# EAGLE design ALMOST4ALLMINI (EAGLE 7.3.0)
CNAME: ALMOST 4 ALL MYSENSORS MINI; CREVISION: 1.1; DESIGNER: joseraj
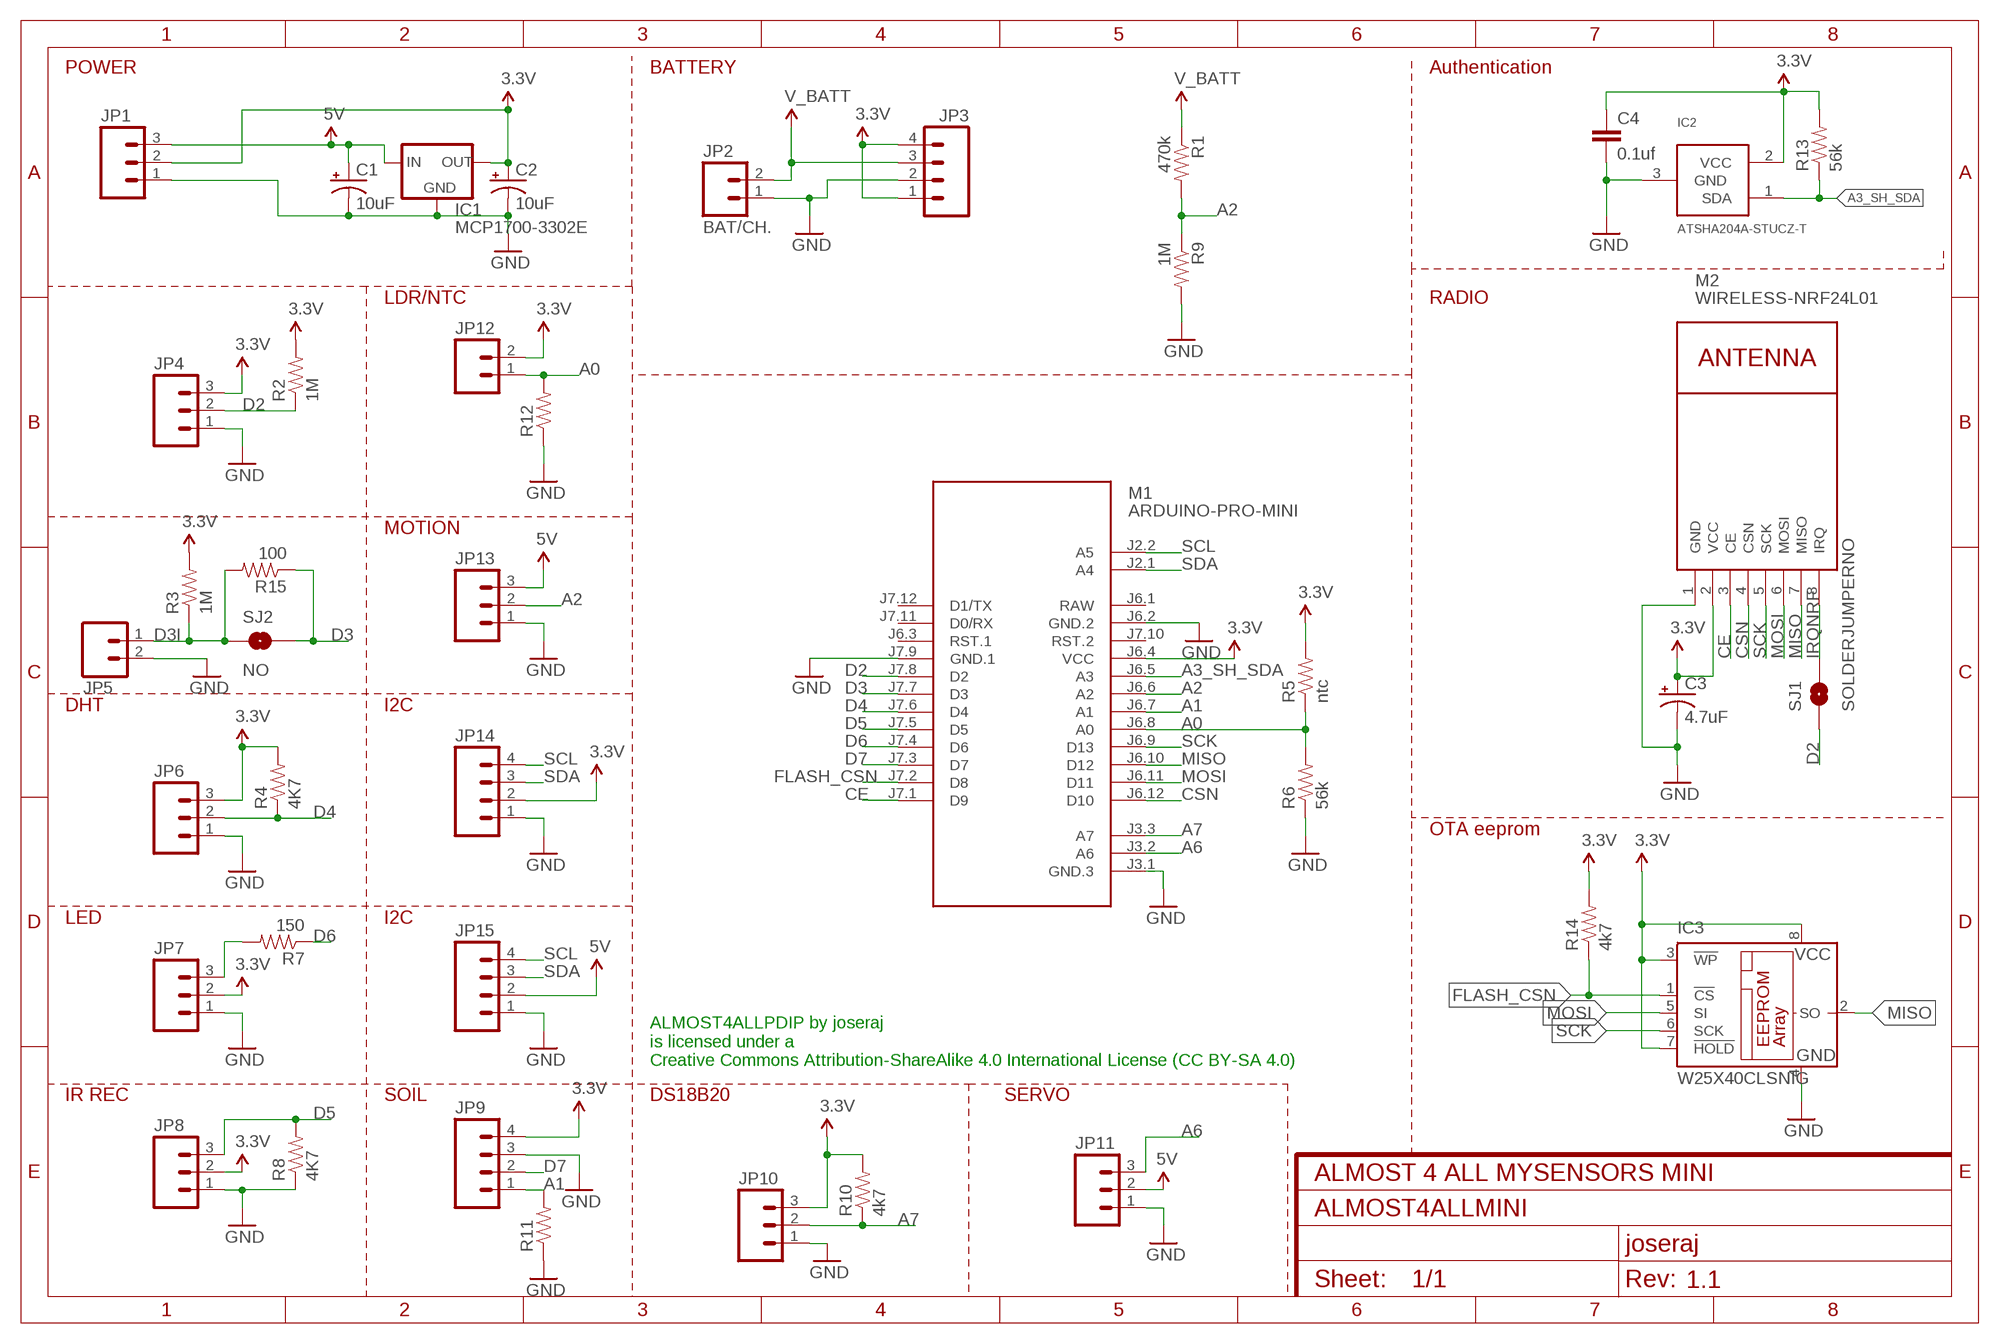
[diagram p0: schematic, sheet 1]

## Parts
C1  10uF  CAP_POLPTH2  [CPOL-RADIAL-10UF-25V]
C2  10uF  CAP_POLPTH2  [CPOL-RADIAL-10UF-25V]
C3  4.7uF  CAP_POLPTH2  [CPOL-RADIAL-10UF-25V]
C4  0.1uf  CAP0805  [0805]
IC1  MCP1700-3302E  MCP1700TRI  [TO92]
IC2  ATSHA204A-STUCZ-T  ATSHA204A  [SOT23]
IC3  W25X40CLSNIG  25LC080SN  [SO-08]
JP1  M03POLAR_LOCK  [MOLEX-1X3_LOCK]
JP2  BAT/CH.  M02POLAR_LOCK  [MOLEX-1X2_LOCK]
JP3  M04NO_SILK_ALL_ROUND  [1X04_NO_SILK_ALL_ROUND]
JP4  M03POLAR_LOCK  [MOLEX-1X3_LOCK]
JP5  M02POLAR_LOCK  [MOLEX-1X2_LOCK]
JP6  M03POLAR_LOCK  [MOLEX-1X3_LOCK]
JP7  M03POLAR_LOCK  [MOLEX-1X3_LOCK]
JP8  M03POLAR_LOCK  [MOLEX-1X3_LOCK]
JP9  M04POLAR_LOCK  [MOLEX-1X4_LOCK]
JP10  M03POLAR_LOCK  [MOLEX-1X3_LOCK]
JP11  M03POLAR_LOCK  [MOLEX-1X3_LOCK]
JP12  M02POLAR_LOCK  [MOLEX-1X2_LOCK]
JP13  M03POLAR_LOCK  [MOLEX-1X3_LOCK]
JP14  M04POLAR_LOCK  [MOLEX-1X4_LOCK]
JP15  M04POLAR_LOCK  [MOLEX-1X4_LOCK]
M1  ARDUINO-PRO-MINI  ARDUINO-PRO-MINI-3.3V#NP  [ARDUINO-PRO-MINI#NP]
M2  WIRELESS-NRF24L01  [WIRELESS-NRF24L01]
R1  470k  RESISTOR0805-RES  [0805]
R2  1M  RESISTOR0805-RES  [0805]
R3  1M  RESISTOR0805-RES  [0805]
R4  4K7  RESISTOR0805-RES  [0805]
R5  ntc  RESISTOR0805-RES  [0805]
R6  56k  RESISTOR0805-RES  [0805]
R7  150  RESISTOR0805-RES  [0805]
R8  4K7  RESISTOR0805-RES  [0805]
R9  1M  RESISTOR0805-RES  [0805]
R10  4k7  RESISTOR0805-RES  [0805]
R11  RESISTOR0805-RES  [0805]
R12  RESISTOR0805-RES  [0805]
R13  56k  RESISTOR0805-RES  [0805]
R14  4k7  RESISTOR0805-RES  [0805]
R15  100  RESISTOR0805-RES  [0805]
SJ1  SOLDERJUMPERNO  [SJ_2S-NO]
SJ2  NO  SOLDERJUMPERNO  [SJ_2S-NO]

## Nets
3.3V: C2.1(+) C3.1(+) C4.1 IC1.3(OUT) IC2.2(VCC) IC3.3(!WP) IC3.7(!HOLD) IC3.8(VCC) JP1.2 JP3.1 JP3.4 JP4.3 JP6.3 JP7.2 JP8.2 JP9.4 JP10.3 JP12.2 JP14.2 M1.J6.4(VCC) M2.2(VCC) R2.2 R3.2 R4.2 R5.2 R10.2 R13.2 R14.2
5V: C1.1(+) IC1.2(IN) JP1.3 JP11.2 JP13.3 JP15.2
A0: JP12.1 M1.J6.8(A0) R5.1 R6.2 R12.2
A1: JP9.1 M1.J6.7(A1) R11.2
A2: JP13.2 M1.J6.6(A2) R1.2 R9.1
A3_SH_SDA: IC2.1(SDA) M1.J6.5(A3) R13.1
A6: JP11.3 M1.J3.2(A6)
A7: JP10.2 M1.J3.3(A7) R10.1
CE: M1.J7.1(D9) M2.3(CE)
CSN: M1.J6.12(D10) M2.4(CSN)
D2: JP4.2 M1.J7.8(D2) R2.1 SJ1.1
D3: M1.J7.7(D3) R15.1 SJ2.2
D3I: JP5.1 R3.1 R15.2 SJ2.1
D4: JP6.2 M1.J7.6(D4) R4.1
D5: JP8.3 M1.J7.5(D5) R8.2
D6: M1.J7.4(D6) R7.1
D7: JP9.2 M1.J7.3(D7)
FLASH_CSN: IC3.1(!CS) M1.J7.2(D8) R14.1
GND: C1.2(-) C2.2(-) C3.2(-) C4.2 IC1.1(GND) IC2.3(GND) IC3.4(GND) JP1.1 JP2.1 JP3.2 JP4.1 JP5.2 JP6.1 JP7.1 JP8.1 JP9.3 JP10.1 JP11.1 JP13.1 JP14.1 JP15.1 M1.J3.1(GND.3) M1.J6.2(GND.2) M1.J7.9(GND.1) M2.1(GND) R6.1 R8.1 R9.2 R11.1 R12.1
IRQNRF: M2.8(IRQ) SJ1.2
MISO: IC3.2(SO) M1.J6.10(D12) M2.7(MISO)
MOSI: IC3.5(SI) M1.J6.11(D11) M2.6(MOSI)
N$5: JP7.3 R7.2
SCK: IC3.6(SCK) M1.J6.9(D13) M2.5(SCK)
SCL: JP14.4 JP15.4 M1.J2.2(A5)
SDA: JP14.3 JP15.3 M1.J2.1(A4)
V_BATT: JP2.2 JP3.3 R1.1
Unconnected: M1.J6.3(RST.1) M1.J7.10(RST.2) M1.J7.11(D0/RX) M1.J7.12(D1/TX)

## Notes on the sheet
- POWER | BATTERY | Authentication
- LDR/NTC | RADIO
- MOTION
- DHT | I2C
- OTA eeprom
- LED | I2C
- ALMOST4ALLPDIP by joseraj 
  is licensed under a 
  Creative Commons Attribution-ShareAlike 4.0 International License (CC BY-SA 4.0)
- IR REC | SOIL | DS18B20 | SERVO

## Power pins joined to a net without a drawn wire
RAW: M1.J6.1(RAW)

## Library data of the parts
C1-C3 = SparkFun-Capacitors:CAP_POL: Capacitor Polarized These are standard SMD and PTH capacitors. Normally 10uF, 47uF, and 100uF in electrolytic and tantalum varieties. Always verify the external diameter of the through hole cap, it varies with capacity, voltage, and manufacturer. The EIA devices should be standard.
C4 = SparkFun-Passives:CAP: Capacitor Standard 0603 ceramic capacitor, and 0.1" leaded capacitor.
IC1 = adafruit:MCP1700: VOLTAGE REGULATOR
IC2 = Sensor_tbowmo:ATSHA204A
IC3 = microchip:25*: Serial EEPROM 4K/ 8K , SPI bus; MF: MICROCHIP; MPN: 25LC080/SN; OC_FARNELL: 1137302; OC_NEWARK: 96K4092
JP1 JP4 JP6-JP8 JP10 JP11 JP13 = jraj:M03: Header 3 Standard 3-pin 0.1" header. Use with straight break away headers (SKU : PRT-00116), right angle break away headers (PRT-00553), swiss pins (PRT-00743), machine pins (PRT-00117), and female headers (PRT-00115). Molex polarized connector foot print use with SKU : PRT-08232 with associated crimp pins and housings.
JP2 JP5 JP12 = jraj:M02: Standard 2-pin 0.1" header. Use with - straight break away headers ( PRT-00116) - right angle break away headers (PRT-00553) - swiss pins (PRT-00743) - machine pins (PRT-00117) - female headers (PRT-00115) Molex polarized connector foot print use with: PRT-08233 with associated crimp pins and housings. 2.54_SCREWTERM for use with PRT-10571. 3.5mm Screw Terminal footprints for PRT-08084 5mm Screw Terminal footprints for use with PRT-08432
JP3 JP9 JP14 JP15 = jraj:M04: Header 4 Standard 4-pin 0.1" header. Use with straight break away headers (SKU : PRT-00116), right angle break away headers (PRT-00553), swiss pins (PRT-00743), machine pins (PRT-00117), and female headers (PRT-00115). Molex polarized connector foot print use with SKU : PRT-08231 with associated crimp pins and housings. 1MM SMD Version SKU: PRT-10208
M1 = diy-modules:ARDUINO-PRO-MINI-*#NP: Arduino Pro Mini without programming pads
M2 = jraj:WIRELESS-NRF24L01: 2.4 GHz Wireless Module based on NRF24L01 chip
R1-R15 = SparkFun-Passives:RESISTOR: Resistor Basic schematic elements and footprints for 0603, 1206, and PTH resistors.
SJ1 SJ2 = SparkFun-Retired:SOLDERJUMPER: Solder Jumper Standard SMD solder jumper. Used to automate production. Two varients : Normally Open and Normally Closed are the same, but have different paste layers. NC will have a large amount of paste and should jumper during reflow.

## Board
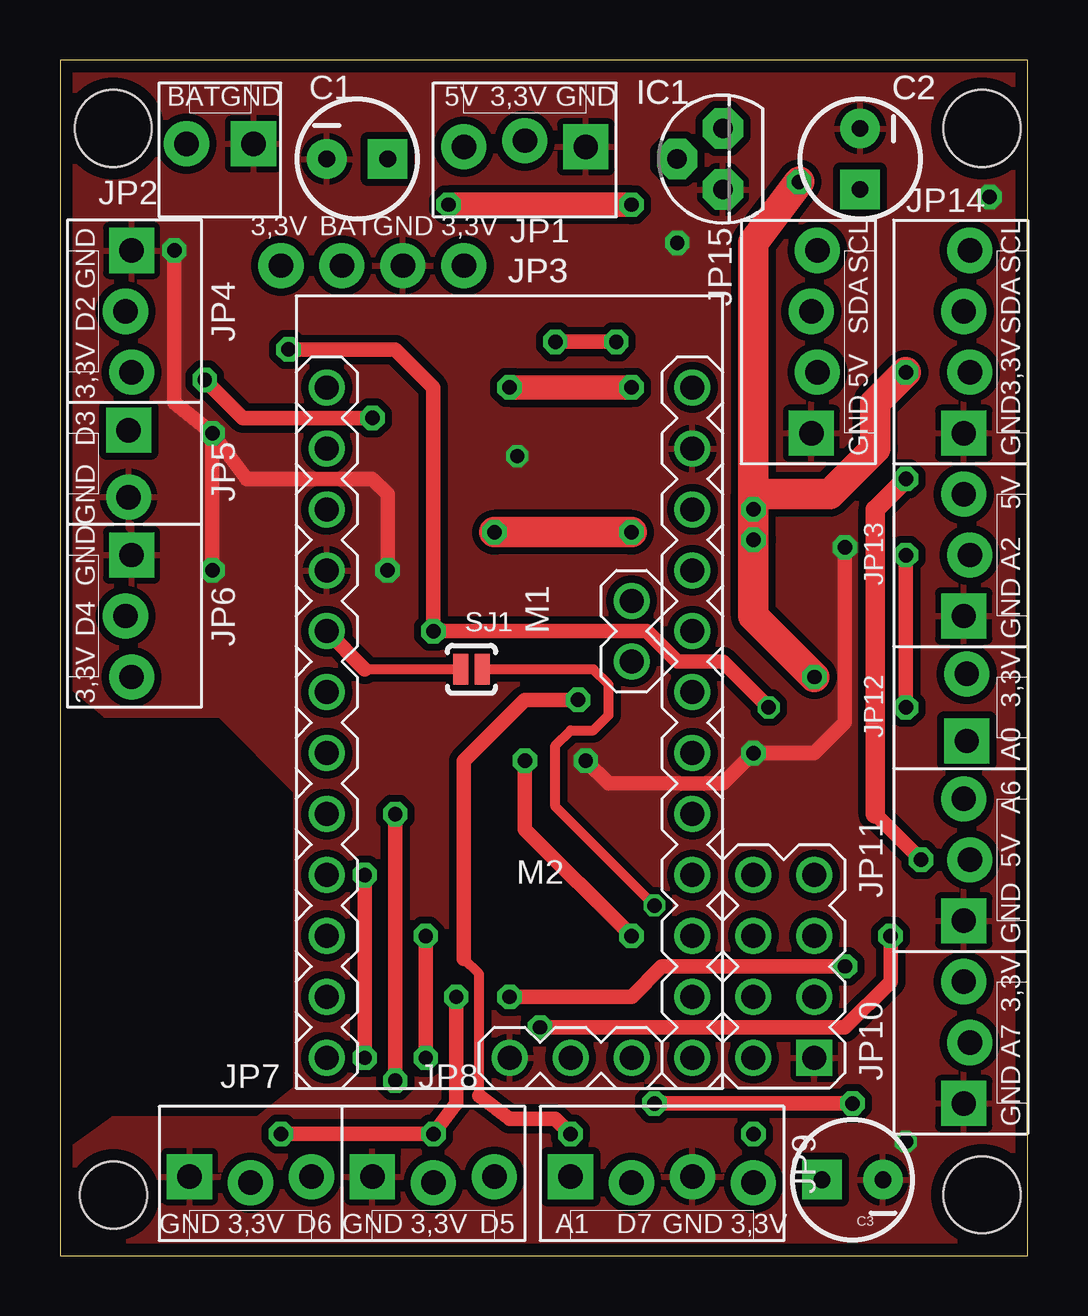
[diagram p1: board, top side]
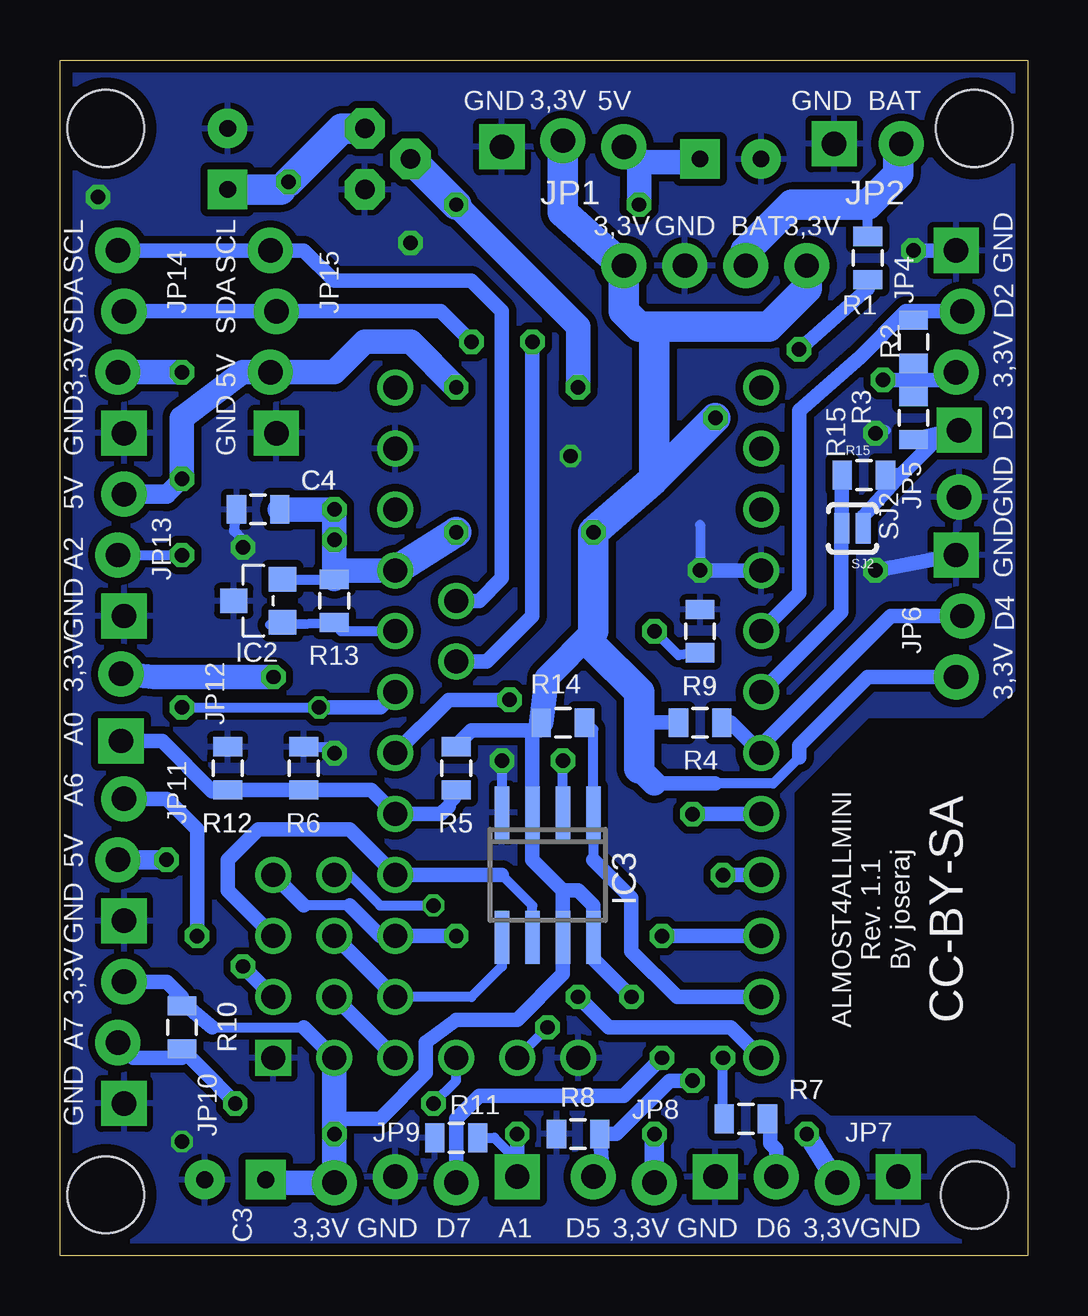
[diagram p2: board, bottom side, seen from below]

Size 40.32 x 49.85 mm. Coordinates in mm from the lower left corner, seen from the top.
Outline: 0,0 40.32,0 40.32,49.85 0,49.85 0,0
Copper layers (1*16): Top 0.035mm / dielectric 1.6mm / Bottom 0.035mm
Design rules "Elecrow_2-layer_PCB_eagle_rule": minimum track width 6mil, minimum drill 12mil, track to track 6mil, track to pad 6mil, pad to pad 6mil, via to via 8mil, smd to smd 0mil, copper to edge 20mil, drill to drill 10mil, minimum pad ring 6mil, minimum via ring 6mil, stop-mask expansion 0mil, vias tented up to drill 100mil, thermal gap 10mil
Holes 2.8 mm at 2.22,2.54
Holes 3.2 mm at 38.42,2.54 2.22,46.99 38.42,46.99

### Footprints (pad centres in the part's own frame; a part is rotated, then mirrored left to right if it is on the bottom)
CPOL-RADIAL-10UF-25V = drill 0.7 pad 1.651 square: 1 1.27,0 | drill 0.7 pad 1.651: 2 -1.27,0
0805 = smd 0.8 x 1.2: 1 -0.9,0; 2 0.9,0
TO92 = drill 0.813 pad 1.676 octagon: 1 -1.27,0; 2 0,1.905; 3 1.27,0
SOT23 = smd 1.016 x 1.143: 1 -0.889,-1.016; 2 0.889,-1.016; 3 0,1.016
SO-08 = smd 0.6 x 2.2: 1 -1.905,-2.6; 2 -0.635,-2.6; 3 0.635,-2.6; 4 1.905,-2.6; 5 1.905,2.6; 6 0.635,2.6; 7 -0.635,2.6; 8 -1.905,2.6
MOLEX-1X3_LOCK = drill 1.016 pad 1.88 square: 1 0,0.127 | drill 1.016 pad 1.88: 2 2.54,-0.127; 3 5.08,0.127
MOLEX-1X2_LOCK = drill 1.016 pad 1.88 square: 1 -0.127,0 | drill 1.016 pad 1.88: 2 2.667,0
1X04_NO_SILK_ALL_ROUND = drill 1.016 pad 1.88: 1 0,0; 2 2.54,0; 3 5.08,0; 4 7.62,0
MOLEX-1X4_LOCK = drill 1.016 pad 1.88 square: 1 0,0.127 | drill 1.016 pad 1.88: 2 2.54,-0.127; 3 5.08,0.127; 4 7.62,-0.127
ARDUINO-PRO-MINI#NP = drill 1: J2.1 -1.27,5.08; J2.2 -3.81,5.08; J3.1 15.24,0; J3.2 15.24,2.54; J3.3 15.24,5.08; J6.1 -12.7,7.62; J6.2 -10.16,7.62; J6.3 -7.62,7.62; J6.4 -5.08,7.62; J6.5 -2.54,7.62; J6.6 0,7.62; J6.7 2.54,7.62; J6.8 5.08,7.62; J6.9 7.62,7.62; J6.10 10.16,7.62; J6.11 12.7,7.62; J6.12 15.24,7.62; J7.1 15.24,-7.62; J7.2 12.7,-7.62; J7.3 10.16,-7.62; J7.4 7.62,-7.62; J7.5 5.08,-7.62; J7.6 2.54,-7.62; J7.7 0,-7.62; J7.8 -2.54,-7.62; J7.9 -5.08,-7.62; J7.10 -7.62,-7.62; J7.11 -10.16,-7.62; J7.12 -12.7,-7.62
WIRELESS-NRF24L01 = drill 1 square: 1 -12.7,6.35 | drill 1: 2 -10.16,6.35; 3 -12.7,3.81; 4 -10.16,3.81; 5 -12.7,1.27; 6 -10.16,1.27; 7 -12.7,-1.27; 8 -10.16,-1.27
SJ_2S-NO = smd 0.635 x 1.27: 1 -0.45,0; 2 0.45,0

### Placement (x,y rotation side)
C1  12.38,45.72 0 top
C2  33.34,45.72 270 top
C3  33.02,3.17 180 top
C4  32.07,31.11 180 bottom
IC1  27.62,45.72 90 top
IC2  32.07,27.3 90 bottom
IC3  20,15.88 180 bottom
JP1  21.91,46.35 180 top
JP2  7.94,46.35 180 top
JP3  16.83,41.27 180 top
JP4  2.86,41.91 270 top
JP5  2.86,34.29 270 top
JP6  2.86,29.21 270 top
JP7  5.4,3.17 0 top
JP8  13.02,3.17 0 top
JP9  21.27,3.17 0 top
JP10  37.78,6.35 90 top
JP11  37.78,13.97 90 top
JP12  37.78,21.59 90 top
JP13  37.78,26.67 90 top
JP14  37.78,34.29 90 top
JP15  31.43,34.29 90 top
M1  18.73,23.5 270 top
M2  18.73,14.61 180 top
R1  6.67,41.59 270 bottom
R2  4.76,38.1 270 bottom
R3  4.76,34.92 90 bottom
R4  13.65,22.23 180 bottom
R5  23.81,20.32 90 bottom
R6  30.16,20.32 270 bottom
R7  11.75,5.71 0 bottom
R8  18.73,5.08 0 bottom
R9  13.65,26.04 90 bottom
R10  35.24,9.53 90 bottom
R11  23.81,4.92 0 bottom
R12  33.34,20.32 270 bottom
R13  28.89,27.3 90 bottom
R14  19.37,22.23 180 bottom
R15  6.83,32.54 0 bottom
SJ1  17.14,24.45 0 top
SJ2  7.3,30.32 180 bottom

### Tracks (layer width: path | path; a pad name or v marks a point on that pad's centre or on a via)
3.3V  (via drill 0.6 pad 1.02)
  Top 0.61: v6.03,36.51 7.62,34.92 v13.02,34.92 | v9.21,5.08 v15.56,5.08 16.51,6.35 v16.51,10.79
  Top 1.27: v31.43,24.13 28.89,26.67 v28.89,29.84 v28.89,31.11 | v28.89,31.11 28.89,31.75 32.07,31.75 33.97,33.66 33.97,35.56 v35.24,36.83 | v23.81,30.16 v18.1,30.16 | v30.8,44.77 28.89,42.23 v28.89,31.11
  Bottom 0.406: IC2.2 29,28.19 R13.2 28.62,28.57 | 20.64,21.95 R14.2 | 13.02,19.68 10.6,19.68 9.53,20.77 | 30.16,9.53 33.97,9.53 R10.2 | JP9.4 28.38,3.17 28.89,3.17 | 18.1,12.38 IC3.8 | 19.37,45.85 JP1.2 | 35.51,10.79 35.24,10.79 | 31.11,44.45 v30.8,44.77 | 23.81,21.27 R5.2 | R2.2 4.76,36.51 R3.2 | 31.7,3.05 31.75,3.05 C3.1
  Bottom 0.61: 19.37,15.24 IC3.7 19.37,11.75 21.27,9.84 23.81,9.84 25.08,8.89 25.08,7.62 26.99,5.71 28.89,5.71 | 19.37,15.24 20.64,16.51 IC3.3 20.64,21.91 | IC3.8 18.1,14.61 18.73,15.24 19.37,15.24 | 20.64,21.91 20.64,21.95 | 13.02,19.68 15.56,19.68 | JP10.3 35.88,11.43 35.24,10.79 | 35.51,10.79 33.97,9.53 | 30.16,9.53 M2.2 | 9.53,20.77 9.53,21.27 6.67,24.13 JP6.3 | v16.51,10.79 18.1,12.38 | R4.2 16.19,22.23 | v6.03,36.51 4.76,36.51 3.3,36.51 JP4.3 | 20.64,21.91 20.32,21.91 | 20.64,21.91 23.18,21.91 23.81,21.27
  Bottom 0.813: JP8.2 v15.56,5.08 | JP7.2 v9.21,5.08
  Bottom 1.016: 28.62,28.57 M1.J6.4 | JP12.2 36.39,24.13 v31.43,24.13 | R13.2 v28.89,29.84 v28.89,31.11 C4.1 | v35.24,36.83 JP14.2 | 15.56,19.68 16.19,20.32 | R14.2 20.05,24.08 18.1,26.04 18.1,25.4 | 31.7,3.05 JP9.4 | M2.2 28.89,5.71 v28.89,5.08 28.89,3.17
  Bottom 1.27: 16.19,20.32 16.19,22.23 16.19,23.5 18.1,25.4 | 18.1,26.04 v18.1,30.16 15.56,32.38 | v13.02,34.92 15.56,32.38 | M1.J6.4 v23.81,30.16 | 15.56,38.73 15.56,32.38 | 19.37,45.85 19.37,43.5 17.59,41.91 JP3.1 16.83,39.37 16.19,38.73 15.56,38.73 | 15.56,38.73 10.79,38.73 9.21,40.32 JP3.4 | IC1.3 28.57,46.99 v30.8,44.77 | C2.1 31.11,44.45
5V  (via drill 0.6 pad 1.02)
  Top 0.61: v35.88,16.51 33.97,18.41
  Top 0.813: 33.97,18.41 33.97,31.11 v35.24,32.38
  Top 1.016: v18.73,36.2 v23.81,36.2 | v23.81,43.81 v16.19,43.81
  Bottom 0.813: JP13.3 35.88,31.75 v35.24,32.38 | JP11.2 v35.88,16.51
  Bottom 1.016: v35.24,32.38 35.24,34.92 32.7,36.83 JP15.2 28.89,36.83 27.62,38.1 25.72,38.1 v23.81,36.2 | v18.73,36.2 18.73,38.73 v23.81,43.81 | JP1.3 16.19,45.59 | 16.19,45.59 v16.19,43.81 | C1.1 13.78,45.59 16.19,45.59
  Bottom 1.27: IC1.2 v23.81,43.81
A0
  Bottom 0.406: 23.81,19.05 24.13,18.73 24.13,19 R5.1 | 30.06,19.42 R6.2 | R12.2 33.71,19.42
  Bottom 0.61: 24.13,18.73 24.45,18.41 M1.J6.8 27.36,19.42 30.06,19.42 | R6.2 R12.2 33.38,19.37 33.97,19.37 36.07,21.46 JP12.1
A1  (via drill 0.6 pad 1.02)
  Top 0.406: 17.46,6.67 17.46,11.75 16.83,12.38
  Top 0.61: 17.46,6.67 18.73,5.71 20.64,5.71 v21.27,5.08 | v21.59,23.18 19.37,23.18 16.83,20.64 16.83,12.38
  Bottom 0.406: R11.2 22.23,4.92 21.27,3.97
  Bottom 0.61: v21.27,5.08 21.27,3.97 JP9.1 | M1.J6.7 24.13,23.18 v21.59,23.18
A2  (via drill 0.6, 0.6 pad 1.02)
  Top 0.61: v35.24,29.21 v35.24,22.86 | v29.53,22.86 27.62,24.77 25.72,24.77 24.45,26.04 v15.56,26.04 15.56,36.2 13.97,37.78 v9.53,37.78
  Bottom 0.406: JP13.2 v35.24,29.21 | v35.24,22.86 v29.53,22.86 | R9.1 14.56,25.04 v15.56,26.04 | R1.2 6.67,40.32
  Bottom 0.61: v29.53,22.86 26.99,22.86 M1.J6.6 | 6.67,40.32 v9.53,37.78
A3_SH_SDA
  Bottom 0.406: M1.J6.5 28.62,26.04 R13.1 31.58,26.3 IC2.1
A6  (via drill 0.6 pad 1.02)
  Top 0.61: v20,9.53 32.7,9.53 34.61,11.43 v34.61,13.34
  Bottom 0.406: M1.J3.2 v20,9.53
  Bottom 0.61: v34.61,13.34 34.61,17.78 35.88,19.05 JP11.3
A7  (via drill 0.6 pad 1.02)
  Top 0.61: v33.02,6.35 v24.77,6.35
  Bottom 0.406: JP10.2 37.27,8.26 | 34.87,8.62 35.24,8.26 R10.1 | v24.77,6.35 23.81,7.3 M1.J3.3
  Bottom 0.61: 37.27,8.26 35.24,8.26 | v33.02,6.35 33.97,7.36 R10.1
CE  (via drill 0.6 pad 1.02)
  Top 0.61: v18.73,10.79 23.81,10.79 25.08,12.06 v32.7,12.06
  Bottom 0.61: M1.J7.1 12.38,9.53 17.46,9.53 v18.73,10.79 | v32.7,12.06 M2.3
CSN
  Bottom 0.61: M2.4 M1.J6.12
D2
  Top 0.406: SJ1.1 12.7,24.45
  Top 0.61: 12.7,24.45 M1.J7.8
  Bottom 0.406: R2.1 4.76,39.37
  Bottom 0.61: M1.J7.8 9.53,27.62 9.53,35.24 6.99,37.47 5.08,39.37 4.76,39.37 JP4.2
D3
  Bottom 0.61: M1.J7.7 7.78,26.83 7.78,30.3 SJ2.2 7.75,32.36 R15.1
D3I
  Bottom 0.406: JP5.1 2.93,34.34
  Bottom 0.61: 2.93,34.34 3.49,34.34 | 3.49,34.34 R3.1 | SJ2.1 6.85,30.82 5.29,32.54 | 5.29,32.54 3.49,34.34 | R15.2 5.29,32.54
D4
  Bottom 0.406: M1.J7.6 11.11,21.27 | 5.4,26.67 JP6.2 | 12.38,22.23 R4.1
  Bottom 0.61: M1.J7.6 12.38,22.23 | 11.11,21.27 5.71,26.67 JP6.2
D5  (via drill 0.6 pad 1.02)
  Top 0.61: v13.97,7.3 v13.97,18.41
  Bottom 0.61: v13.97,18.41 M1.J7.5 | JP8.3 17.73,3.67 R8.2 17.14,5.08 14.92,7.3 v13.97,7.3
D6  (via drill 0.6 pad 1.02)
  Top 0.61: v12.7,8.26 v12.7,15.88
  Bottom 0.406: v12.7,8.26 12.7,5.71 R7.1
  Bottom 0.61: v12.7,15.88 M1.J7.4
D7  (via drill 0.6 pad 1.02)
  Top 0.61: v15.24,13.34 v15.24,8.26
  Bottom 0.61: M1.J7.3 v15.24,13.34 | v15.24,8.26 16.83,6.67 22.86,6.67 23.81,5.71 JP9.2
FLASH_CSN
  Bottom 0.406: 18.1,16.51 IC3.1 18.1,21.95 R14.1
  Bottom 0.61: 18.1,16.51 16.51,14.92 16.51,12.7 14.61,10.79 M1.J7.2
GND  (via drill 0.6, 0.6 pad 1.02)
  Top 0.61: v13.65,28.57 13.65,31.75 13.02,32.38 7.78,32.38 v6.35,34.29 | v6.35,28.57 v6.35,34.29 | v32.7,29.53 32.7,22.23 31.43,20.95 v28.89,20.95 27.62,19.68 22.86,19.68 v21.91,20.64 | v6.35,34.29 4.76,35.56 v4.76,41.91
  Bottom 0.406: 13.65,30.48 v13.65,28.57 | 5.91,34.42 v6.35,34.29 | R6.1 29.16,21.22 v28.89,20.95 | v32.7,29.53 32.7,29.84 33.07,30.21 C4.2 | v21.91,20.64 IC3.4
  Bottom 0.61: M1.J7.9 v13.65,28.57 | JP6.1 v6.35,28.57 | v4.76,41.91 JP4.1
  other vias: 38.73,44.13 35.24,4.76 19.05,33.34 25.72,42.23
  pour Bottom (isolate 0.305): 6.67,22.54 1.91,22.54 0,24.13 0,49.85 40.32,49.85 40.32,0 0,0 0,4.13 2.22,5.71 8.26,5.71 9.84,6.99 9.84,19.37
  pour Top (isolate 0.305): 0,24.13 0,49.85 40.32,49.85 40.32,0 0,0 0,4.13 2.22,5.71 8.26,5.71 9.84,6.99 9.84,19.37 6.67,22.54 1.91,22.54
IRQNRF  (via drill 0.6)
  Top 0.406: v24.77,14.61 20.64,18.73 20.64,21.27 21.27,21.91 22.23,21.91 22.86,22.54 22.86,23.81 22.23,24.45 SJ1.2
  Bottom 0.406: M2.8 28.26,15.88 26.99,14.61 v24.77,14.61
MISO  (via drill 0.6 pad 1.02)
  Top 0.61: v19.37,20.64 19.37,17.78 v23.81,13.34
  Bottom 0.406: 28.26,14.61 30.16,14.61 | IC3.2 v19.37,20.64 | M1.J6.10 26.99,13.34
  Bottom 0.61: 30.16,14.61 M2.7 | v23.81,13.34 M1.J6.10 | 26.99,13.34 28.26,14.61
MOSI
  Bottom 0.406: IC3.5 21.91,12.06 23.18,10.79 M1.J6.11
  Bottom 0.61: M2.6 M1.J6.11
N$5
  Bottom 0.406: R7.2 10.72,5.71
  Bottom 0.61: JP7.3 10.48,4.45 10.72,4.69 10.72,5.71
SCK
  Bottom 0.406: IC3.6 20.64,14.61 21.91,15.88
  Bottom 0.61: M2.5 33.34,15.24 33.34,16.51 32.07,17.78 28.26,17.78 M1.J6.9 21.91,15.88
SCL
  Bottom 0.61: M1.J2.2 22.86,27.3 21.91,28.26 21.91,39.37 23.18,40.64 28.89,40.64 30.16,41.91 JP15.4 JP14.4
SDA  (via drill 0.6 pad 1.02)
  Top 0.61: v20.64,38.1 v23.18,38.1
  Bottom 0.61: JP14.3 JP15.3 24.45,39.37 v23.18,38.1 | M1.J2.1 22.54,24.77 20.64,26.67 v20.64,38.1
V_BATT
  Bottom 0.406: JP2.2 5.4,46.35 | R1.1 6.67,43.81
  Bottom 1.27: 5.4,46.35 5.4,45.09 6.67,43.81 9.84,43.81 11.75,41.91 JP3.3

### Text on the board
_tNames: BAT | GND | C1 | 5V | 3,3V | GND | IC1 | C2 | JP2 | GND | 3,3V | BAT | GND | 3,3V | JP15 | JP14 | JP1 | JP3 | SCL | SCL | D2 | 3,3V | JP4 | SDA | SDA | 5V | 3,3V | D3 | GND | GND | GND | JP5 | 5V | GND | A2 | M1 | JP13 | D4 | SJ1 | GND | 3,3V | JP6 | 3,3V | JP12 | A0 | A6 | 5V | JP11 | GND | 3,3V | A7 | JP7 | JP8 | JP10 | JP9 | GND | GND | 3,3V | D6 | GND | 3,3V | D5 | A1 | D7 | GND | 3,3V
_bNames: BAT | GND | 5V | 3,3V | GND | JP2 | JP1 | 3,3V | BAT | GND | 3,3V | JP15 | JP14 | GND | SCL | SCL | JP4 | D2 | SDA | SDA | 3,3V | 5V | 3,3V | R15 | D3 | GND | GND | C4 | GND | JP5 | JP13 | 5V | SJ2 | A2 | GND | D4 | GND | JP6 | IC2 | JP12 | 3,3V | R9 | 3,3V | JP11 | A0 | A6 | R5 | R12 | IC3 | 5V | CC-BY-SA | ALMOST4ALLMINI / Rev. 1.1 / By joseraj | GND | R10 | 3,3V | A7 | JP10 | R7 | JP8 | R8 | JP7 | JP9 | GND | GND | 3,3V | D6 | GND | 3,3V | D5 | A1 | D7 | GND | 3,3V | C3